# EAGLE schematic Receiver (EAGLE 7.6.0)
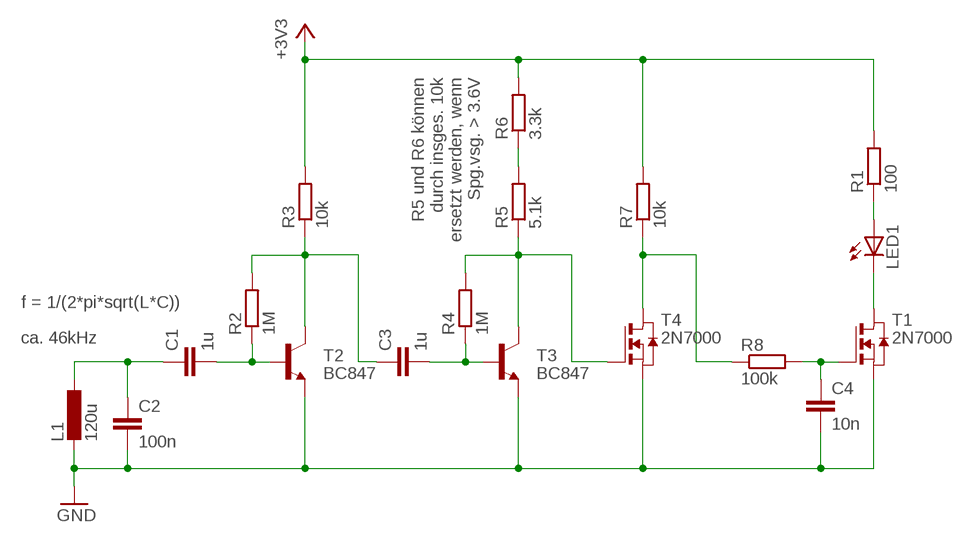
[diagram p0: schematic, sheet 1]

## Parts
C1  1u  C-EUC0603  [C0603]
C2  100n  C-EUC0603  [C0603]
C3  1u  C-EUC0603  [C0603]
C4  10n  C-EUC0603  [C0603]
L1  120u  L-EUL1812  [L1812]
LED1  LEDCHIPLED_0603  [CHIPLED_0603]
R1  100  R-EU_R0603  [R0603]
R2  1M  R-EU_R0603  [R0603]
R3  10k  R-EU_R0603  [R0603]
R4  1M  R-EU_R0603  [R0603]
R5  5.1k  R-EU_R0603  [R0603]
R6  3.3k  R-EU_R0603  [R0603]
R7  10k  R-EU_R0603  [R0603]
R8  100k  R-EU_R0603  [R0603]
T1  2N7000  NMOSSOT23  [SOT-23]
T2  BC847  [SOT23]
T3  BC847  [SOT23]
T4  2N7000  NMOSSOT23  [SOT-23]

## Nets
+3V3: R1.2 R3.2 R6.2 R7.2
GND: C2.2 C4.2 L1.2 T1.2(S) T2.2(E) T3.2(E) T4.2(S)
N$1: C1.1 C2.1 L1.1
N$2: C1.2 R2.1 T2.1(B)
N$3: C3.1 R2.2 R3.1 T2.3(C)
N$4: C3.2 R4.1 T3.1(B)
N$5: R4.2 R5.1 T3.3(C) T4.3(G)
N$7: R5.2 R6.1
N$8: R7.1 R8.1 T4.1(D)
N$11: C4.1 R8.2 T1.3(G)
N$12: LED1.C T1.1(D)
N$13: LED1.A R1.1

## Notes on the sheet
- R5 und R6 können
  durch insges. 10k
  ersetzt werden, wenn
  Spg.vsg. > 3.6V
- f = 1/(2*pi*sqrt(L*C))
- ca. 46kHz

## Library data of the parts
C1-C4 = resistor:C-EU: CAPACITOR, European symbol
L1 = resistor:L-EU: INDUCTOR, European symbol
LED1 = led:LED: LED OSRAM: - CHIPLED LG R971, LG N971, LY N971, LG Q971, LY Q971, LO R971, LY R971 LH N974, LH R974 LS Q976, LO Q976, LY Q976 LO Q996 - Hyper CHIPLED LW Q18S LB Q993, LB Q99A, LB R99A - SideLED LS A670, LO A670, LY A670, LG A670, LP A670 LB A673, LV A673, LT A673, LW A673 LH A674 LY A675 LS A676, LA A676, LO A676, LY A676, LW A676 LS A679, LY A679, LG A679 - Hyper Micro SIDELED® LS Y876, LA Y876, LO Y876, LY Y876 LT Y87S - SmartLED LW L88C, LW L88S LB L89C, LB L89S, LG L890 LS L89K, LO L89K, LY L89K LS L896, LA L896, LO L896, LY L896 - TOPLED LS T670, LO T670, LY T670, LG T670, LP T670 LSG T670, LSP T670, LSY T670, LOP T670, LYG T670 LG T671, LOG T671, LSG T671 LB T673, LV T673, LT T673, LW T673 LH T674 LS T676, LA T676, LO T676, LY T676, LB T676, LH T676, LSB T676, LW T676 LB T67C, LV T67C, LT T67C, LS T67K, LO T67K, LY T67K, LW E67C LS E67B, LA E67B, LO E67B, LY E67B, LB E67C, LV E67C, LT E67C LW T67C LS T679, LY T679, LG T679 LS T770, LO T770, LY T770, LG T770, LP T770 LB T773, LV T773, LT T773, LW T773 LH T774 LS E675, LA E675, LY E675, LS T675 LS T776, LA T776, LO T776, LY T776, LB T776 LHGB T686 LT T68C, LB T68C - Hyper Mini TOPLED® LB M676 - Mini TOPLED Santana® LG M470 LS M47K, LO M47K, LY M47K Source: http://www.osram.convergy.de LUXEON: - LUMILED® LXK2-PW12-R00, LXK2-PW12-S00, LXK2-PW14-U00, LXK2-PW14-V00 LXK2-PM12-R00, LXK2-PM12-S00, LXK2-PM14-U00 LXK2-PE12-Q00, LXK2-PE12-R00, LXK2-PE12-S00, LXK2-PE14-T00, LXK2-PE14-U00 LXK2-PB12-K00, LXK2-PB12-L00, LXK2-PB12-M00, LXK2-PB14-N00, LXK2-PB14-P00, LXK2-PB14-Q00 LXK2-PR12-L00, LXK2-PR12-M00, LXK2-PR14-Q00, LXK2-PR14-R00 LXK2-PD12-Q00, LXK2-PD12-R00, LXK2-PD12-S00 LXK2-PH12-R00, LXK2-PH12-S00 LXK2-PL12-P00, LXK2-PL12-Q00, LXK2-PL12-R00 Source: www.luxeon.com KINGBRIGHT: KA-3528ASYC Source: www.kingbright.com
R1-R8 = resistor:R-EU_: RESISTOR, European symbol
T1 T4 = zetex:NMOSSOT23: MOS FET; OC_FARNELL: unknown; OC_NEWARK: unknown
T2 T3 = transistor:BC847: NPN TRANSISTOR